# Altium schematic sheet Sheet1.SchDoc
size A
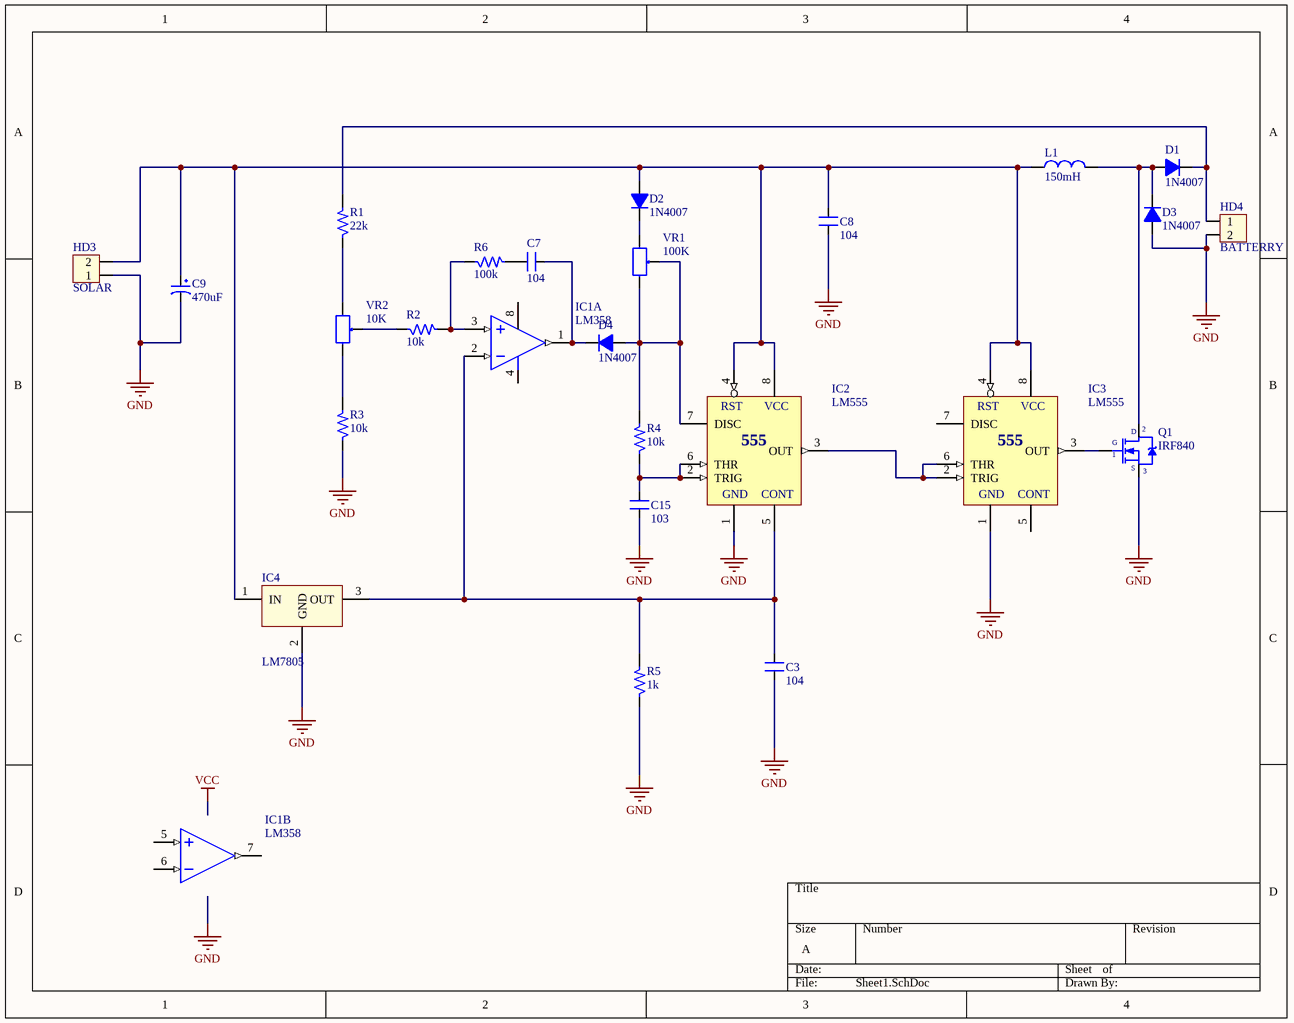
[diagram p0: Sheet1.SchDoc]

## Parts
C3  104  [CN2]
C7  104  [CN1]
C8  104  [CN1]
C9  470uF  [CP1/2]
C15  103  [CN1]
D1  1N4007  [D1A]
D2  1N4007  [D1A]
D3  1N4007  [D1A]
D4  1N4007  [D1A]
HD3  SOLAR  [HED2]
HD4  BATTERRY  [HED2]
IC1  LM358  [DIP8/W0.3]  (parts A,B of 2)
IC2  LM555  [DIP8/W0.3]
IC3  LM555  [DIP8/W0.3]
IC4  LM7805  [QTO-220]
L1  150mH  [L/0.4]
Q1  IRF840  [QTO-220]
R1  22k  [SM-RES-1206]
R2  10k  [SM-RES-1206]
R3  10k  [SM-RES-1206]
R4  10k  [SM-RES-1206]
R5  1k  [SM-RES-1206]
R6  100k  [SM-RES-1206]
VR1  100K  [VR]
VR2  10K  [VR]

## Nets
GND: C3.1 C8.1 C9.2 C15.1 D3.1(A) HD3.1 HD4.2 IC2.1(GND) IC3.1(GND) IC4.2(GND) Q1.3(S) R3.1 R5.1
NetC3_2: C3.2 IC1.2(IN-) IC2.5(CONT) IC4.3(OUT) R5.2
NetC7_1: C7.1 D4.2(K) IC1.1(OUT)
NetC7_2: C7.2 R6.2
NetC8_2: C8.2 C9.1 D2.1(A) HD3.2 IC2.4(RST) IC2.8(VCC) IC3.4(RST) IC3.8(VCC) IC4.1(IN) L1.1
NetC15_2: C15.2 IC2.2(TRIG) IC2.6(THR) R4.1
NetD1_1: D1.1(A) D3.2(K) L1.2 Q1.2(D)
NetD1_2: D1.2(K) HD4.1 R1.2
NetD2_2: D2.2(K) VR1.1
NetD4_1: D4.1(A) IC2.7(DISC) R4.2 VR1.2 VR1.3
NetIC1_3: IC1.3(IN+) R2.2 R6.1
NetIC2_3: IC2.3(OUT) IC3.2(TRIG) IC3.6(THR)
NetIC3_3: IC3.3(OUT) Q1.1(G)
NetR1_1: R1.1 VR2.1
NetR2_1: R2.1 VR2.2
NetR3_2: R3.2 VR2.3

Not connected (* = marked no-connect by the designer): IC1 4(-V) 5(IN+) 6(IN-) 7(OUT) 8(+V); IC3 5(CONT) 7(DISC)

## Notes on the sheet
- (in symbol LM555) 555

## Library data of the parts
C3 = CN2: Cap np 104 => 105pF; Value: 0.1uF
C7 C8 C15 = CN1: Cap np  1pF - 472pF; Value: 100pF
C9 = CP1: Cap P  0,1uF < 22uF , 16 - 50V; Value: 10uF/50V; Description 1: 10 => 220uF/6,3V/10V - 10uF => 100uF/16V; Description 2: 0,1uF => 33uF/50V - 10uF => 22uF/63V; Description 3: 0,47uF => 10uF/100V
D1-D4 = D1A: Diode 1A; Value: 1N4007
HD3 HD4 = Hed2: Header 2 (Green); Value: Header 2
IC1 = LM358: Low-Power Dual Operational Amplifier; Value: LM358
IC2 IC3 = LM555: Timer; Value: LM555
IC4 = LM78xx: On ap +, from + 5 to + 24VDC; Value: LM7805
L1 = L1: Inductor; Value: 150 mH
Q1 = IRF840: MOSFET N - CHANNEL 500V - 0.75 - 8A - TO-220; Value: IRF840
R1-R6 = R: Resistor 1/4W; Value: R1/4W - 1K
VR1 VR2 = VR: Var Resistor; Value: VR 10K